# Altium schematic sheet Atmel ATmega 328P PLC_2021-10-04.schdoc
size 426 x 293 mm
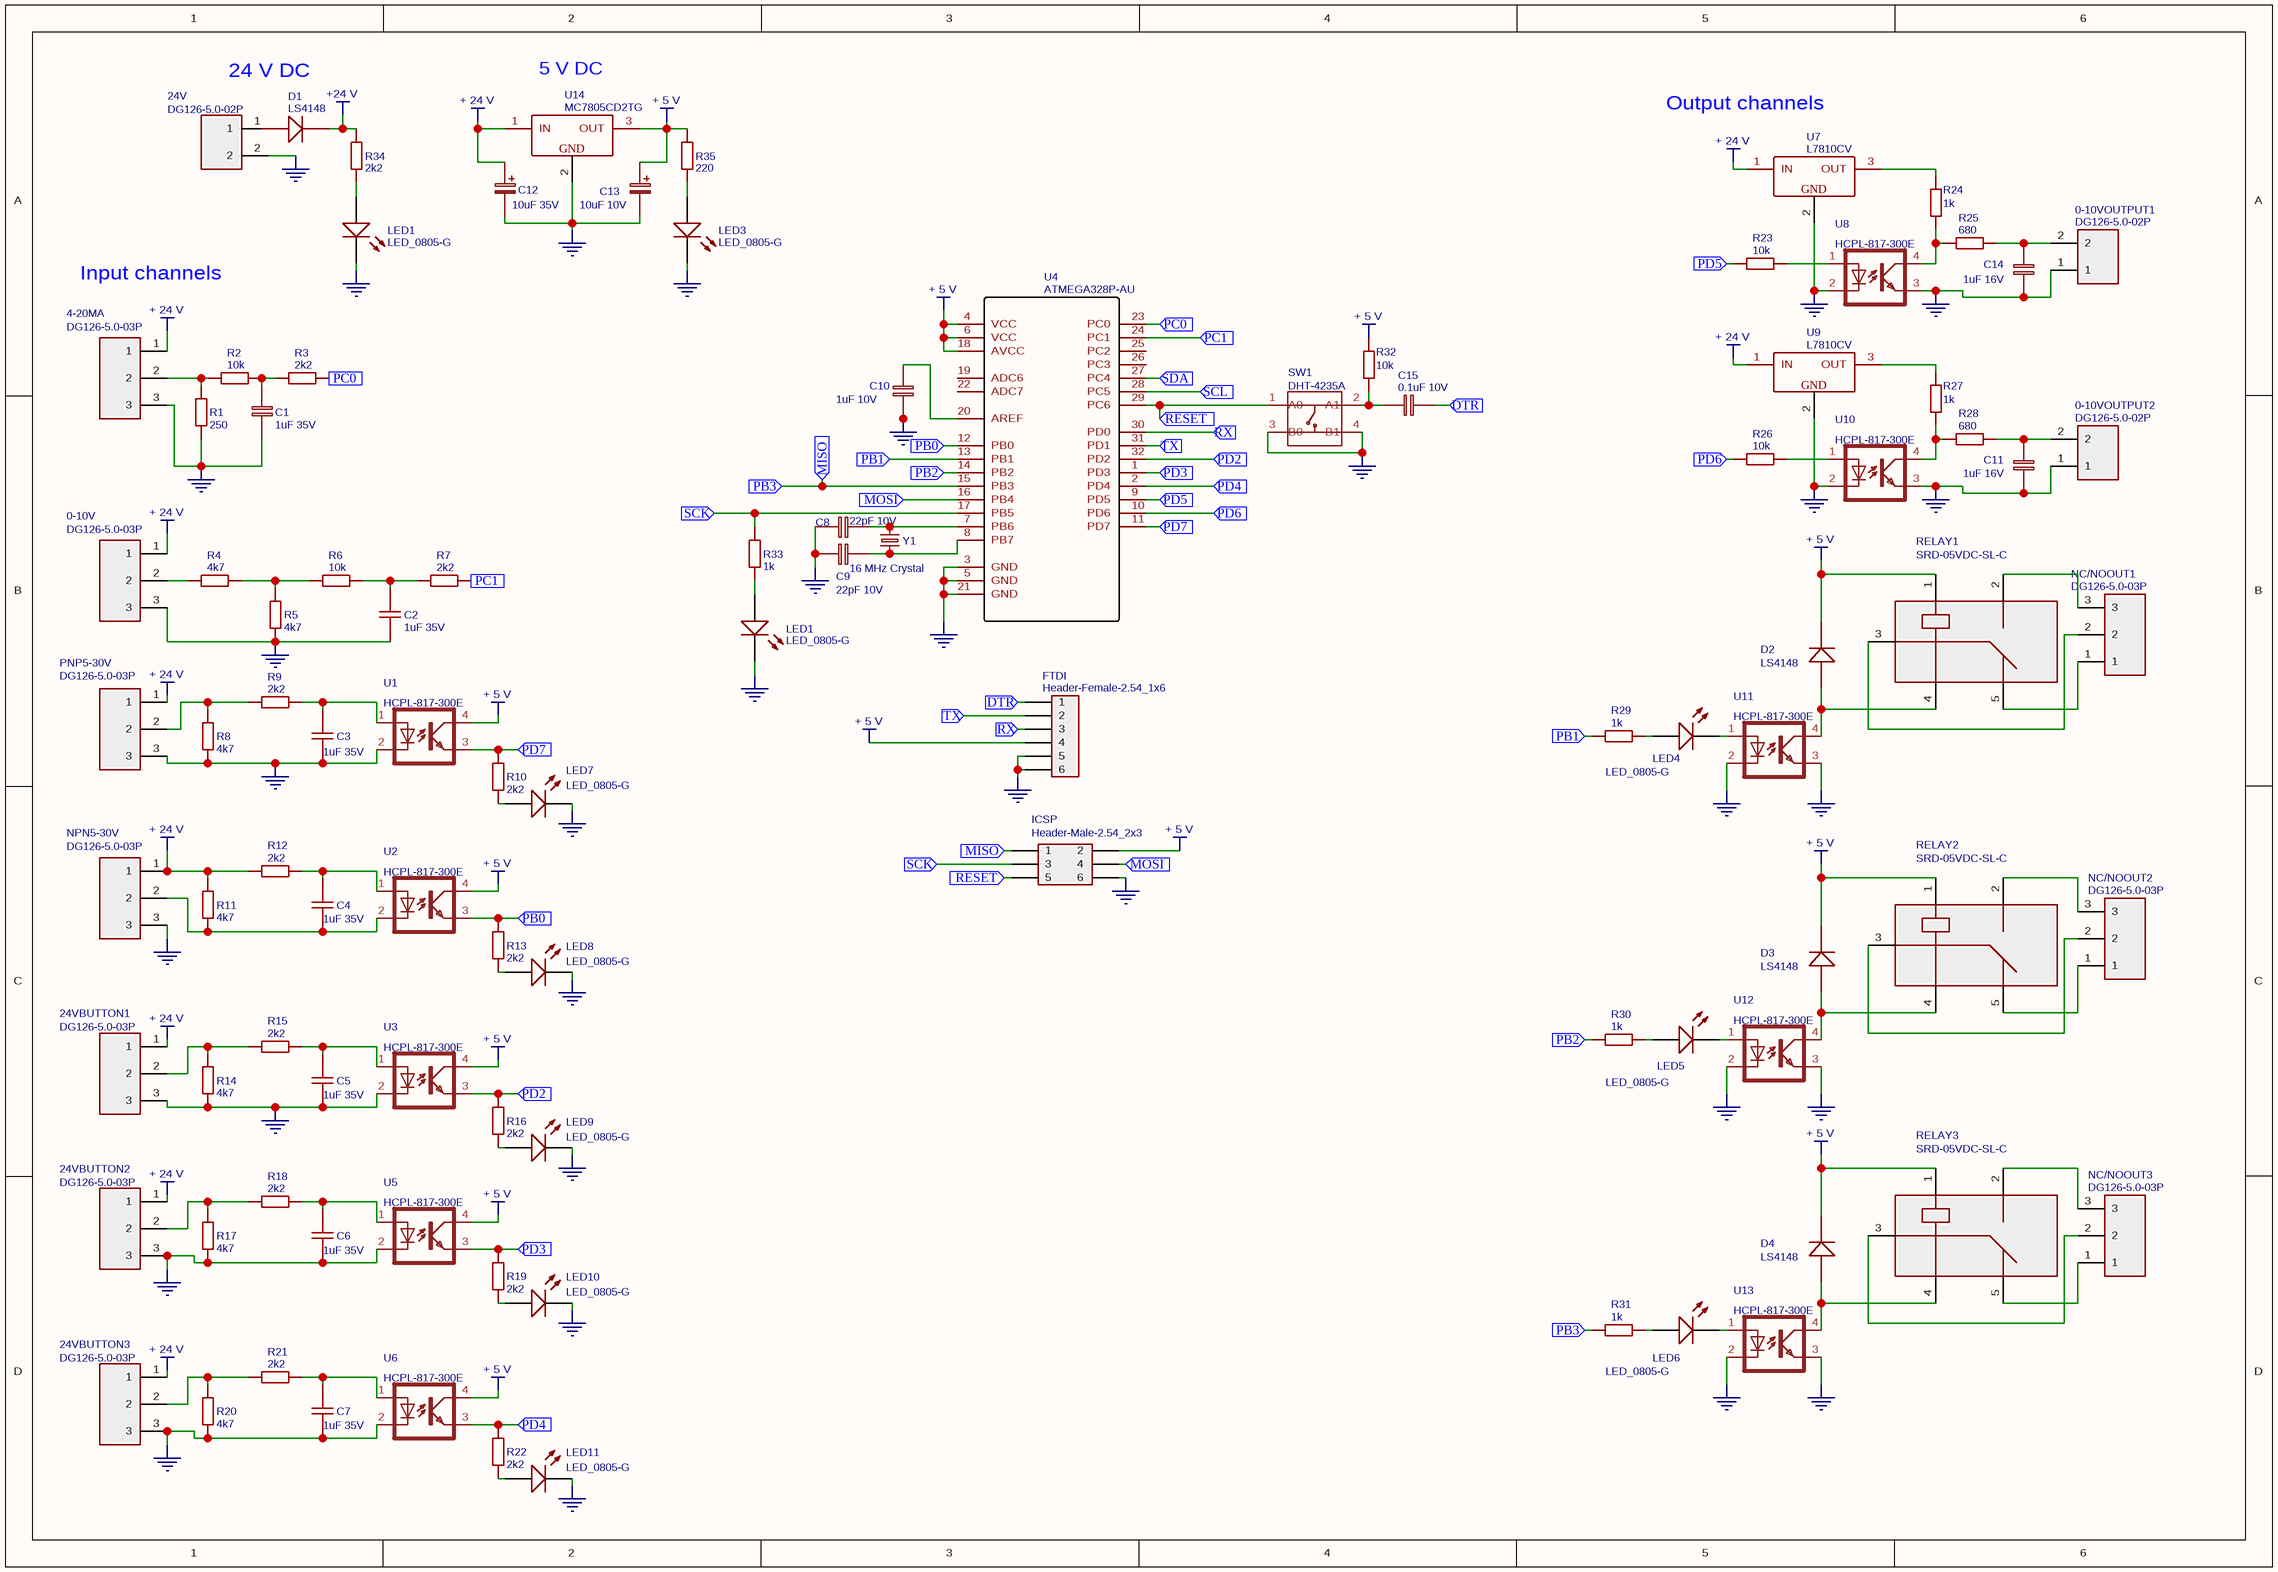
[diagram p0: Atmel ATmega 328P PLC_2021-10-04.schdoc]

## Parts
(Parts that share a designator on the sheet are numbered #1, #2 ... from top to bottom, then left to right.)
0-10V  DG126-5.0-03P  [DG126 SCREW TERMINAL BLOCK 3 POSITIONS 5MM]
0-10VOUTPUT1  DG126-5.0-02P  [DG126 SCREW TERMINAL BLOCK 2 POSITIONS 5MM]
0-10VOUTPUT2  DG126-5.0-02P  [DG126 SCREW TERMINAL BLOCK 2 POSITIONS 5MM]
4-20MA  DG126-5.0-03P  [DG126 SCREW TERMINAL BLOCK 3 POSITIONS 5MM]
24V  DG126-5.0-02P  [DG126 SCREW TERMINAL BLOCK 2 POSITIONS 5MM]
24VBUTTON1  DG126-5.0-03P  [DG126 SCREW TERMINAL BLOCK 3 POSITIONS 5MM]
24VBUTTON2  DG126-5.0-03P  [DG126 SCREW TERMINAL BLOCK 3 POSITIONS 5MM]
24VBUTTON3  DG126-5.0-03P  [DG126 SCREW TERMINAL BLOCK 3 POSITIONS 5MM]
C1  1uF 35V  [1206-CAP]
C2  1uF 35V  [1206-CAP]
C3  1uF 35V  [1206-CAP]
C4  1uF 35V  [1206-CAP]
C5  1uF 35V  [1206-CAP]
C6  1uF 35V  [1206-CAP]
C7  1uF 35V  [1206-CAP]
C8  22pF 10V  [1206 CAPACITOR]
C9  22pF 10V  [1206 CAPACITOR]
C10  1uF 10V  [1206-CAP]
C11  1uF 16V  [1206-CAP]
C12  10uF 35V  [CP_ELEC_4X5.3]
C13  10uF 10V  [CP_ELEC_4X5.3]
C14  1uF 16V  [1206-CAP]
C15  0.1uF 10V  [1206 CAPACITOR]
D1  LS4148  [1206 DIODE]
D2  LS4148  [1206 DIODE]
D3  LS4148  [1206 DIODE]
D4  LS4148  [1206 DIODE]
FTDI  Header-Female-2.54_1x6  [HDR-6X1/2.54]
ICSP  Header-Male-2.54_2x3  [HDR-3X2/2.54]
LED1#1  LED_0805-G  [0805 LED]
LED1#2  LED_0805-G  [0805 LED]
LED3  LED_0805-G  [0805 LED]
LED4  LED_0805-G  [0805 LED]
LED5  LED_0805-G  [0805 LED]
LED6  LED_0805-G  [0805 LED]
LED7  LED_0805-G  [0805 LED]
LED8  LED_0805-G  [0805 LED]
LED9  LED_0805-G  [0805 LED]
LED10  LED_0805-G  [0805 LED]
LED11  LED_0805-G  [0805 LED]
NC/NOOUT1  DG126-5.0-03P  [DG126 SCREW TERMINAL BLOCK 3 POSITIONS 5MM]
NC/NOOUT2  DG126-5.0-03P  [DG126 SCREW TERMINAL BLOCK 3 POSITIONS 5MM]
NC/NOOUT3  DG126-5.0-03P  [DG126 SCREW TERMINAL BLOCK 3 POSITIONS 5MM]
NPN5-30V  DG126-5.0-03P  [DG126 SCREW TERMINAL BLOCK 3 POSITIONS 5MM]
PNP5-30V  DG126-5.0-03P  [DG126 SCREW TERMINAL BLOCK 3 POSITIONS 5MM]
R1  250  [1206]
R2  10k  [1206]
R3  2k2  [1206]
R4  4k7  [1206]
R5  4k7  [1206]
R6  10k  [1206]
R7  2k2  [1206]
R8  4k7  [1206]
R9  2k2  [1206]
R10  2k2  [1206]
R11  4k7  [1206]
R12  2k2  [1206]
R13  2k2  [1206]
R14  4k7  [1206]
R15  2k2  [1206]
R16  2k2  [1206]
R17  4k7  [1206]
R18  2k2  [1206]
R19  2k2  [1206]
R20  4k7  [1206]
R21  2k2  [1206]
R22  2k2  [1206]
R23  10k  [1206]
R24  1k  [1206]
R25  680  [1206]
R26  10k  [1206]
R27  1k  [1206]
R28  680  [1206]
R29  1k  [1206]
R30  1k  [1206]
R31  1k  [1206]
R32  10k  [1206]
R33  1k  [1206]
R34  2k2  [1206]
R35  220  [1206]
RELAY1  SRD-05VDC-SL-C  [RELAY-SL-SRD]
RELAY2  SRD-05VDC-SL-C  [RELAY-SL-SRD]
RELAY3  SRD-05VDC-SL-C  [RELAY-SL-SRD]
SW1  DHT-4235A  [SW4-SMD-4.2X3.2X2.5MM]
U1  HCPL-817-300E  [HCPL-817-300E V2]
U2  HCPL-817-300E  [HCPL-817-300E V2]
U3  HCPL-817-300E  [HCPL-817-300E V2]
U4  ATMEGA328P-AU  [TQFP-32_7X7X08P]
U5  HCPL-817-300E  [HCPL-817-300E V2]
U6  HCPL-817-300E  [HCPL-817-300E V2]
U7  L7810CV  [TO-220(TO-220-3)]
U8  HCPL-817-300E  [HCPL-817-300E V2]
U9  L7810CV  [TO-220(TO-220-3)]
U10  HCPL-817-300E  [HCPL-817-300E V2]
U11  HCPL-817-300E  [HCPL-817-300E V2]
U12  HCPL-817-300E  [HCPL-817-300E V2]
U13  HCPL-817-300E  [HCPL-817-300E V2]
U14  MC7805CD2TG  [936-03]
Y1  16 MHz Crystal  [HC49UP]

## Ports
DTR (in), MISO (in), MOSI (in), PB0 (in), PB1 (in), PB2 (in), PB3 (in), PC0 (in), PC1 (in), PD2 (in), PD3 (in), PD4 (in), PD5 (in), PD6 (in), PD7 (in), RESET (in), RX (in), SCK (in), SCL (in), SDA (in), TX (in)

## Nets
+24 V: D1.2(K) R34.2
+ 5 V: C13.1 D2.2(K) D3.2(K) D4.2(K) FTDI.4 ICSP.2 R32.2 R35.2 RELAY1.1 RELAY2.1 RELAY3.1 U1.4 U2.4 U3.4 U4.4(VCC) U4.6(VCC) U4.18(AVCC) U5.4 U6.4 U14.3(OUT)
+ 24 V: 0-10V.1 4-20MA.1 24VBUTTON1.1 24VBUTTON2.1 24VBUTTON3.1 C12.1 NPN5-30V.1 PNP5-30V.1 R11.2 R12.2 U7.1(IN) U9.1(IN) U14.1(IN)
GND: 0-10V.3 0-10VOUTPUT1.1 0-10VOUTPUT2.1 4-20MA.3 24V.2 24VBUTTON1.3 24VBUTTON2.3 24VBUTTON3.3 C1.2 C2.1 C3.1 C5.1 C6.1 C7.1 C8.2 C9.2 C10.2 C11.2 C12.2 C13.2 C14.2 FTDI.5 FTDI.6 ICSP.6 LED1#1.2(C) LED1#2.2(C) LED3.2(C) LED7.2(C) LED8.2(C) LED9.2(C) LED10.2(C) LED11.2(C) NPN5-30V.3 PNP5-30V.3 R1.2 R5.1 R8.1 R14.1 R17.1 R20.1 SW1.3(B0) SW1.4(B1) U1.2 U3.2 U4.3(GND) U4.5(GND) U4.21(GND) U5.2 U6.2 U7.2(GND) U8.2 U8.3 U9.2(GND) U10.2 U10.3 U11.2 U11.3 U12.2 U12.3 U13.2 U13.3 U14.2(GND)
DTR: C15.2 FTDI.1 ; port DTR
MISO: ICSP.1 R31.1 U4.15(PB3) ; port PB3, port MISO
MOSI: ICSP.4 U4.16(PB4) ; port MOSI
PB0: R13.2 U2.3 U4.12(PB0) ; port PB0
PB1: R29.1 U4.13(PB1) ; port PB1
PB2: R30.1 U4.14(PB2) ; port PB2
PC0: R3.2 U4.23(PC0) ; port PC0
PC1: R7.1 U4.24(PC1) ; port PC1
PD2: R16.2 U3.3 U4.32(PD2) ; port PD2
PD3: R19.2 U4.1(PD3) U5.3 ; port PD3
PD4: R22.2 U4.2(PD4) U6.3 ; port PD4
PD5: R23.2 U4.9(PD5) ; port PD5
PD6: R26.2 U4.10(PD6) ; port PD6
PD7: R10.2 U1.3 U4.11(PD7) ; port PD7
RESET: ICSP.5 SW1.1(A0) U4.29(PC6) ; port RESET
RX: FTDI.3 U4.30(PD0) ; port RX
SCK: ICSP.3 R33.2 U4.17(PB5) ; port SCK
SCL: U4.28(PC5) ; port SCL
SDA: U4.27(PC4) ; port SDA
TX: FTDI.2 U4.31(PD1) ; port TX
Net0-10V_2: 0-10V.2 R4.1
Net0-10VOUTPUT1_2: 0-10VOUTPUT1.2 C14.1 R25.2
Net0-10VOUTPUT2_2: 0-10VOUTPUT2.2 C11.1 R28.2
Net4-20MA_2: 4-20MA.2 R1.1 R2.1
Net24VBUTTON1_2: 24VBUTTON1.2 R14.2 R15.2
Net24VBUTTON2_2: 24VBUTTON2.2 R17.2 R18.2
Net24VBUTTON3_2: 24VBUTTON3.2 R20.2 R21.2
NetC1_1: C1.1 R2.2 R3.1
NetC2_2: C2.2 R6.1 R7.2
NetC3_2: C3.2 R9.1 U1.1
NetC4_1: C4.1 NPN5-30V.2 R11.1 U2.2
NetC4_2: C4.2 R12.1 U2.1
NetC5_2: C5.2 R15.1 U3.1
NetC6_2: C6.2 R18.1 U5.1
NetC7_2: C7.2 R21.1 U6.1
NetC8_1: C8.1 U4.7(PB6) Y1.2
NetC9_1: C9.1 U4.8(PB7) Y1.1
NetC10_1: C10.1 U4.20(AREF)
NetC15_1: C15.1 R32.1 SW1.2(A1)
NetD2_1: D2.1(A) RELAY1.4 U11.4
NetD3_1: D3.1(A) RELAY2.4 U12.4
NetD4_1: D4.1(A) RELAY3.4 U13.4
NetLED1#1_1: LED1#1.1(A) R34.1
NetLED1#2_1: LED1#2.1(A) R33.1
NetLED3_1: LED3.1(A) R35.1
NetLED4_1: LED4.1(A) R29.2
NetLED4_2: LED4.2(C) U11.1
NetLED5_1: LED5.1(A) R30.2
NetLED5_2: LED5.2(C) U12.1
NetLED6_1: LED6.1(A) R31.2
NetLED6_2: LED6.2(C) U13.1
NetLED7_1: LED7.1(A) R10.1
NetLED8_1: LED8.1(A) R13.1
NetLED9_1: LED9.1(A) R16.1
NetLED10_1: LED10.1(A) R19.1
NetLED11_1: LED11.1(A) R22.1
NetNC/NOOUT1_1: NC/NOOUT1.1 RELAY1.5
NetNC/NOOUT1_2: NC/NOOUT1.2 RELAY1.3
NetNC/NOOUT1_3: NC/NOOUT1.3 RELAY1.2
NetNC/NOOUT2_1: NC/NOOUT2.1 RELAY2.5
NetNC/NOOUT2_2: NC/NOOUT2.2 RELAY2.3
NetNC/NOOUT2_3: NC/NOOUT2.3 RELAY2.2
NetNC/NOOUT3_1: NC/NOOUT3.1 RELAY3.5
NetNC/NOOUT3_2: NC/NOOUT3.2 RELAY3.3
NetNC/NOOUT3_3: NC/NOOUT3.3 RELAY3.2
NetPNP5-30V_2: PNP5-30V.2 R8.2 R9.2
NetR4_2: R4.2 R5.2 R6.2
NetR23_1: R23.1 U8.1
NetR24_1: R24.1 U7.3(OUT)
NetR24_2: R24.2 R25.1 U8.4
NetR26_1: R26.1 U10.1
NetR27_1: R27.1 U9.3(OUT)
NetR27_2: R27.2 R28.1 U10.4

Not connected (* = marked no-connect by the designer): 24V 1; D1 1(A); U4 19(ADC6) 22(ADC7) 25(PC2) 26(PC3)

## Notes on the sheet
- 24 V DC
- (near U14) 5 V DC
- Output channels
- Input channels

## Library data of the parts
0-10V 4-20MA 24VBUTTON1-24VBUTTON3 NC/NOOUT1-NC/NOOUT3 NPN5-30V PNP5-30V = DG126-5.0-03P: BOM_Manufacturer Part: DG126-5.0-03P-14-00A(H); BOM_Supplier: LCSC; spicePre: P; BOM_Supplier Part: C8401
0-10VOUTPUT1 0-10VOUTPUT2 24V = DG126-5.0-02P: BOM_Manufacturer Part: DG126-5.0-02P-14-00A; BOM_Supplier: LCSC; spicePre: P; BOM_Supplier Part: C8404
C1-C7 = 1uF 35V: BOM_Manufacturer Part: CC1206MKY5V9BB105; nameAlias: Value(F); spicePre: C; spiceSymbolName: Capacitor
C8 C9 = 22pF 10V: BOM_Manufacturer Part: VJ1206A220JXACW1BC; nameAlias: Value(F); spicePre: C; spiceSymbolName: Capacitor
C10 = 1uF 10V: BOM_Manufacturer Part: CC1206MKY5V9BB105; nameAlias: Value(F); spicePre: C; spiceSymbolName: Capacitor
C11 C14 = 1uF 16V: BOM_Manufacturer Part: CC1206MKY5V9BB105; nameAlias: Value(F); spicePre: C; spiceSymbolName: Capacitor
C12 = 10uF 35V: BOM_Manufacturer Part: SC1V106M04005VR; nameAlias: Value(F); spicePre: C; spiceSymbolName: Capacitor
C13 = 10uF 10V: BOM_Manufacturer Part: SC1V106M04005VR; nameAlias: Value(F); spicePre: C; spiceSymbolName: Capacitor
C15 = 0.1uF 10V: BOM_Manufacturer Part: VJ1206G104KXQCW1BC; nameAlias: Value(F); spicePre: C; spiceSymbolName: Capacitor
ICSP = Header-Male-2.54_2x3: BOM_Manufacturer Part: 2.54mm2*3P; BOM_Supplier: LCSC; spicePre: P; BOM_Supplier Part: C65114
LED1#1 LED1#2 LED3-LED11 = LED_0805-G: BOM_Manufacturer Part: LED_0805-G-; SMD 0805 led green 15-23mcd; BOM_Supplier: LCSC; spicePre: L; BOM_Supplier Part: C73643
R1 = 250: BOM_Manufacturer Part: ERJ8ENF2490V; nameAlias: Value(Ω); spicePre: R; spiceSymbolName: Resistor
R2 R6 R23 R26 R32 = 10k: BOM_Manufacturer Part: RC1206FR-0710K; nameAlias: Value(Ω); spicePre: R; spiceSymbolName: Resistor
R3 R7 R9 R10 R12 R13 R15 R16 R18 R19 R21 R22 R34 = 2k2: BOM_Manufacturer Part: RC1206FR-072K2L; nameAlias: Value(Ω); spicePre: R; spiceSymbolName: Resistor
R4 R5 R8 R11 R14 R17 R20 = 4k7: BOM_Manufacturer Part: 1206S4F4701T5E; nameAlias: Value(Ω); spicePre: R; spiceSymbolName: Resistor
R24 R27 R29-R31 R33 = 1k: BOM_Manufacturer Part: RC1206FR-071KL; nameAlias: Value(Ω); spicePre: R; spiceSymbolName: Resistor
R25 R28 = 680: BOM_Manufacturer Part: RC1206FR-07680RL; nameAlias: Value(Ω); spicePre: R; spiceSymbolName: Resistor
R35 = 220: BOM_Manufacturer Part: RC1206FR-07220RL; nameAlias: Value(Ω); spicePre: R; spiceSymbolName: Resistor
SW1 = DHT-4235A: BOM_Manufacturer Part: KMR221G LFS; catid: 20; description: SMD Button Top; spicePre: S
U1-U3 U5 U6 U8 U10-U13 = HCPL-817-300E: Contributor: A-TOM; BOM_Manufacturer Part: HCPL-817-300E; spicePre: U
U4 = ATMEGA328P-AU: catid: 20; BOM_Supplier: LCSC; BOM_Manufacturer Part: ATMEGA328P-AU; spicePre: U; BOM_Supplier Part: C14877
U7 U9 = L7810CV: catid: 20; BOM_Supplier: LCSC; BOM_Manufacturer Part: L7810CV; spicePre: U; BOM_Supplier Part: C8091
U14 = MC7805CD2TG: catid: 20; BOM_Supplier: LCSC; spicePre: U; BOM_Manufacturer Part: MC7805CD2TG; BOM_Supplier Part: C16807
Y1 = 16 MHz Crystal: BOM_Manufacturer Part: HC49USM-FF3F18-16.0000; catid: 20; spicePre: Y
D1-D4 = LS4148: BOM_Supplier: LCSC; BOM_Manufacturer Part: LS4148; spicePre: D; BOM_Supplier Part: C14516
FTDI = Header-Female-2.54_1x6: BOM_Supplier: LCSC; BOM_Manufacturer Part: Header-Female-2.54_1x6; spicePre: P; BOM_Supplier Part: C40877
RELAY1-RELAY3 = SRD-05VDC-SL-C: BOM_Supplier: LCSC; BOM_Manufacturer Part: SRD-05VDC-SL-C; spicePre: R; BOM_Supplier Part: C35449